# EAGLE design BMI270-SensorBoard (EAGLE 9.6.2)
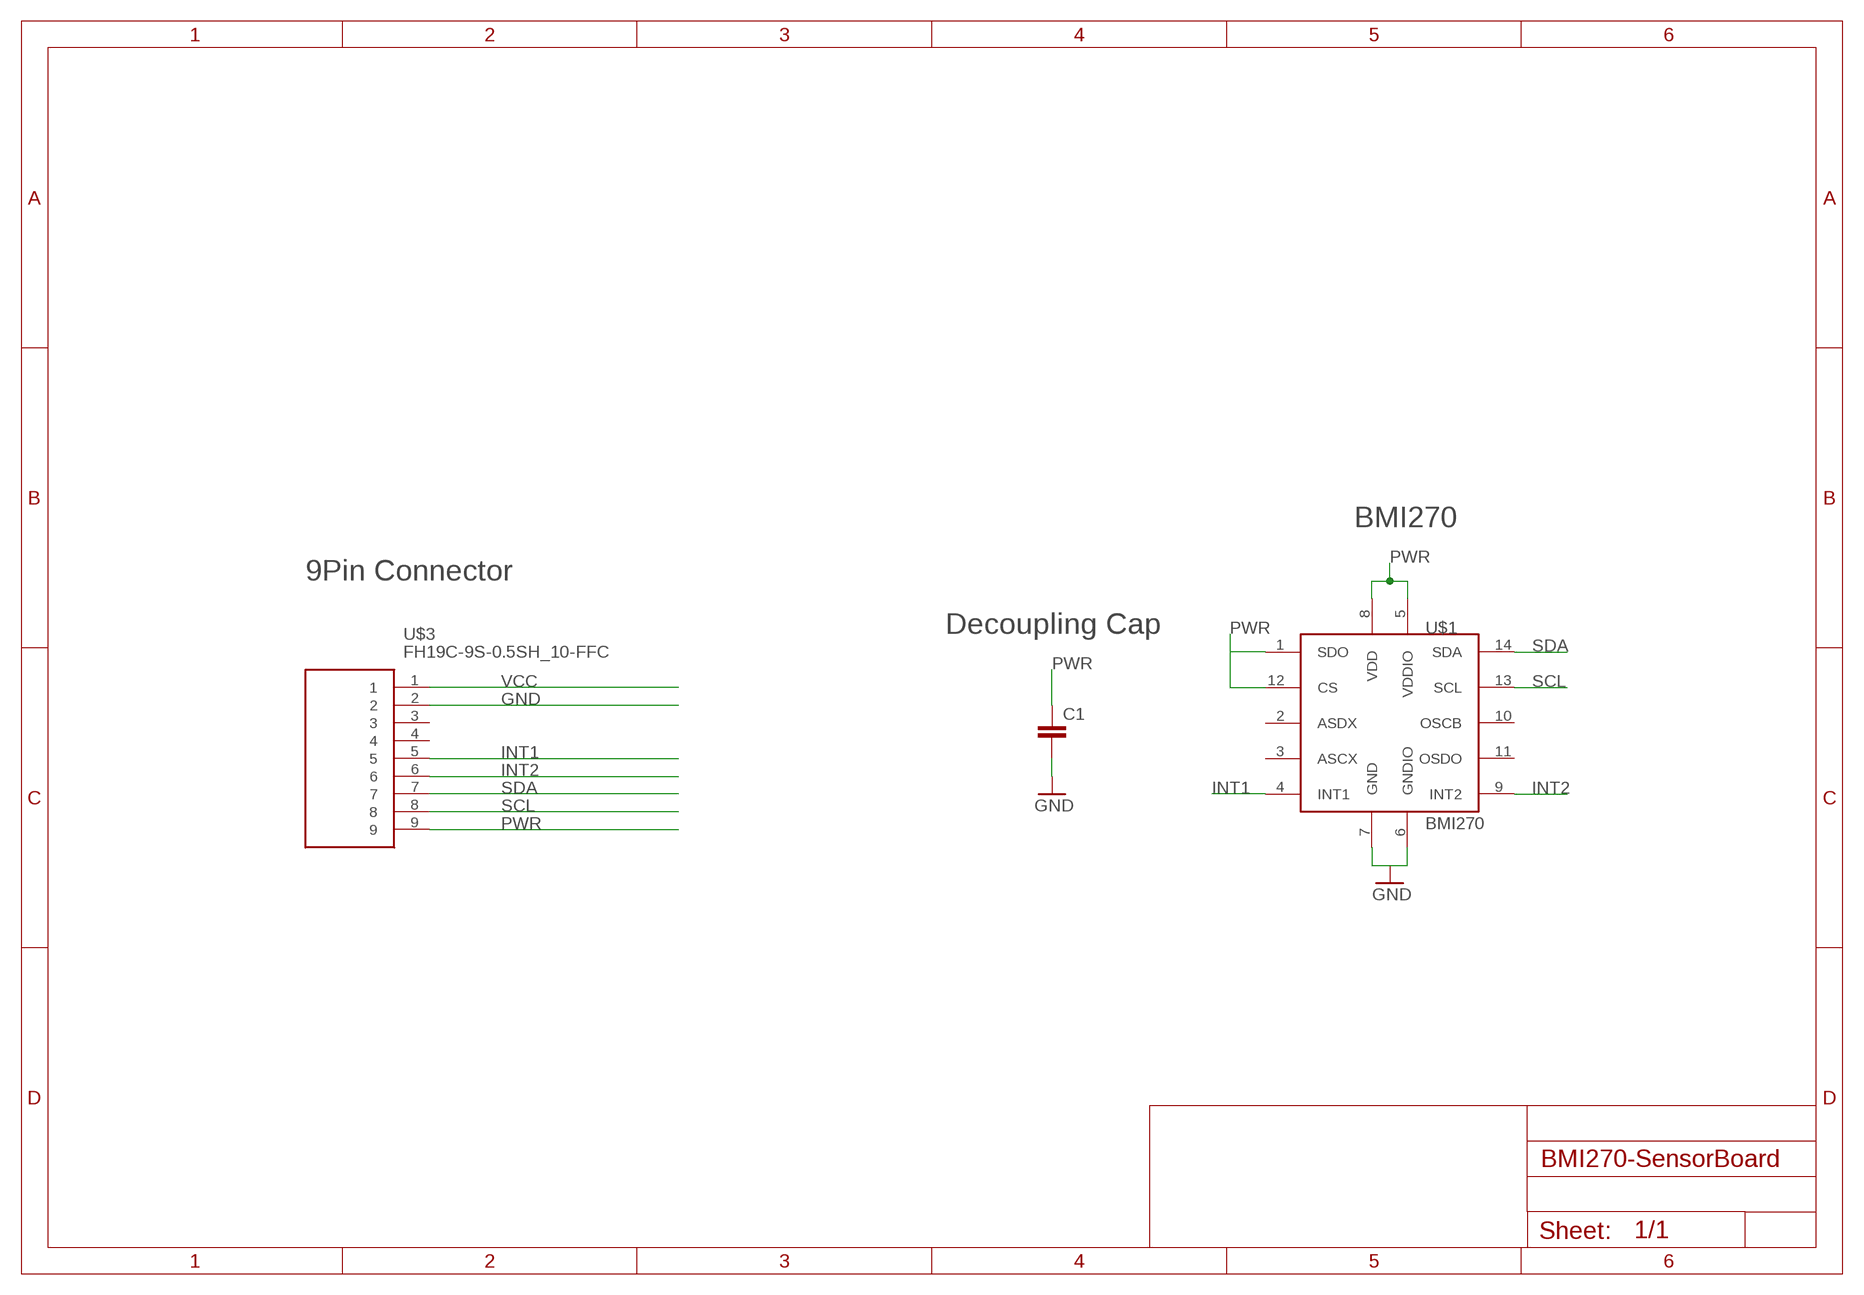
[diagram p0: schematic, sheet 1]

## Parts
C1  C-EUC0603K  [C0603K]
U$1  BMI270  [XDCR_BMI270]
U$3  FH19C-9S-0.5SH_10-FFC  [FH19C9S05SH10-FFC]

## Nets
GND [gnd]: C1.2 U$1.6(GNDIO) U$1.7(GND) U$3.2
INT1: U$1.4(INT1) U$3.5
INT2: U$1.9(INT2) U$3.6
PWR: C1.1 U$1.1(SDO) U$1.5(VDDIO) U$1.8(VDD) U$1.12(CS) U$3.9
SCL: U$1.13(SCL) U$3.8
SDA: U$1.14(SDA) U$3.7
VCC: U$3.1
Unconnected: U$1.2(ASDX) U$1.3(ASCX) U$1.10(OSCB) U$1.11(OSDO) U$3.3 U$3.4

## Notes on the sheet
- BMI270
- 9Pin Connector
- Decoupling Cap

## Library data of the parts
C1 = rcl:C-EU: CAPACITOR, European symbol; SPICEPREFIX: C
U$1 = BMI270:BMI270
U$3 = FH19C-9S-0.5SH:FH19C-9S-0.5SH_10-FFC

## Net classes
0 default: width 0.203 mm
1 power: width 0.203 mm
2 gnd: width 0.203 mm

## Board
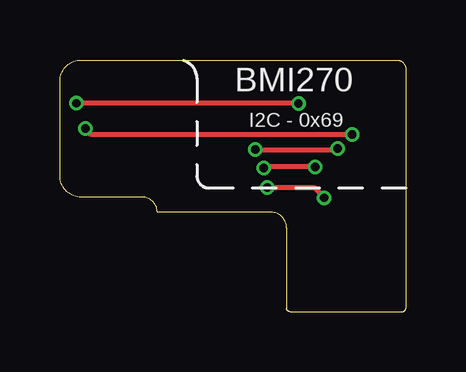
[diagram p1: board, top side]
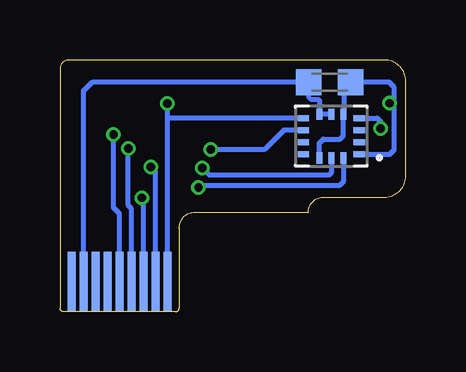
[diagram p2: board, bottom side, seen from below]

Size 14.43 x 10.49 mm. Coordinates in mm from the lower left corner, seen from the top.
Outline: 9.45,3.5 arc90 8.81,4.13 4.06,4.13 arc90 3.43,4.77 0.89,4.77 arc-90 0,5.66 0,9.6 arc-90 0.89,10.49 14.05,10.49 arc-90 14.43,10.1 14.43,3.5
Copper layers (1*16): Top 0.035559375mm / dielectric 4mil / Bottom 0.035559375mm
Design rules "oshpark-2layer *": minimum track width 6mil, minimum drill 10mil, track to track 6mil, track to pad 6mil, pad to pad 6mil, via to via 6mil, smd to smd 6mil, copper to edge 15mil, drill to drill 6mil, minimum pad ring 5mil, minimum via ring 5mil, stop-mask expansion 2.5mil, vias tented up to drill 12mil, thermal gap 10mil

### Footprints (pad centres in the part's own frame; a part is rotated, then mirrored left to right if it is on the bottom)
C0603K = smd 1.05 x 1.08: 1 -0.875,0; 2 0.875,0
XDCR_BMI270 = smd 0.475 x 0.25: 1 -1.163,0.75; 2 -1.163,0.25; 3 -1.163,-0.25; 4 -1.163,-0.75; 8 1.163,-0.75; 9 1.163,-0.25; 10 1.163,0.25; 11 1.163,0.75 | smd 0.25 x 0.475: 5 -0.5,-0.912; 6 0,-0.912; 7 0.5,-0.912; 12 0.5,0.912; 13 0,0.912; 14 -0.5,0.912
FH19C9S05SH10-FFC = smd 0.347 x 2.5 bottom: 1 2,-2.25; 2 1.5,-2.25; 3 1,-2.25; 4 0.5,-2.25; 5 0,-2.25; 6 -0.5,-2.25; 7 -1,-2.25; 8 -1.5,-2.25; 9 -2,-2.25

### Placement (x,y rotation side)
C1  3.18,9.55 180 bottom
U$1  3.11,7.31 180 bottom
U$3  11.94,3.5 0 top

### Tracks (layer width: path | path; a pad name or v marks a point on that pad's centre or on a via)
GND
  Bottom 0.203: U$1.6 U$1.7 3.6,8.24 3.6,8.79 3.65,8.84 3.96,8.84 4.05,8.94 C1.2 13.09,9.55 13.44,9.2 U$3.2
INT1  (via drill 0.35)
  Top 0.203: v12.19,7.37 1.31,7.37 v1.06,7.62
  Bottom 0.203: U$3.5 11.94,4.08 12.19,4.33 v12.19,7.37 | U$1.4 1.19,8.06 1.06,7.93 v1.06,7.62
INT2  (via drill 0.35)
  Top 0.203: v8.14,6.75 11.53,6.75 v11.58,6.8
  Bottom 0.203: U$1.9 5.09,7.56 5.9,6.75 v8.14,6.75 | U$3.6 11.44,4.28 11.58,4.42 v11.58,6.8
PWR  (via drill 0.35)
  Top 0.203: v9.95,8.67 v0.69,8.67 v0.68,8.68
  Bottom 0.203: U$3.9 9.94,7.52 9.95,7.53 9.95,8.06 | U$1.12 3.61,7.02 3.45,7.18 2.75,7.18 2.61,7.32 U$1.5 2.59,8.25 2.59,9.27 C1.1 0.7,9.56 0.48,9.35 0.48,8.67 | U$1.1 0.66,6.56 0.48,6.74 0.48,8.67 | 9.95,8.06 v9.95,8.67 | v0.68,8.68 0.49,8.68 0.48,8.67 | U$1.8 9.95,8.06
SCL  (via drill 0.35)
  Top 0.203: v10.64,6.03 8.55,6.03 v8.5,5.98
  Bottom 0.203: U$3.8 10.44,5.83 v10.64,6.03 | U$1.13 3.11,5.78 3.21,5.68 8.2,5.68 v8.5,5.98
SDA  (via drill 0.35)
  Top 0.203: v8.65,5.18 10.58,5.18 v11.02,4.74
  Bottom 0.203: U$1.14 2.61,5.4 2.74,5.27 8.56,5.27 v8.65,5.18 | U$3.7 10.94,4.66 v11.02,4.74

### Text on the board
tPlace: BMI270 | I2C - 0x69